# Altium schematic sheet Sheet1.SchDoc
size A4; SheetNumber: 5; SheetTotal: 5
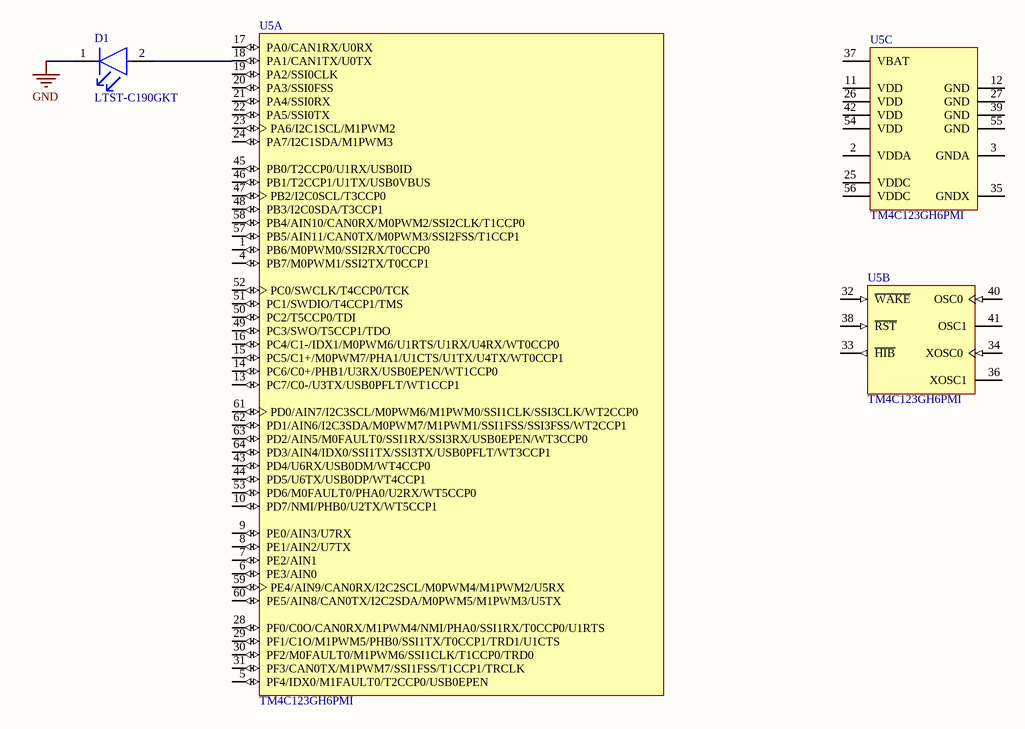
[diagram p0: Sheet1.SchDoc]

## Parts
D1  LTST-C190GKT  [FP-LTST-C190GKT-MFG]
U5  TM4C123GH6PMI  [PM0064A_L]  (parts A,B,C of 3)

## Nets
GND: D1.1(C)
NetD1_2: D1.2(A) U5.18(PA1/CAN1TX/U0TX)

Not connected (* = marked no-connect by the designer): U5 1(PB6/M0PWM0/SSI2RX/T0CCP0) 2(VDDA) 3(GNDA) 4(PB7/M0PWM1/SSI2TX/T0CCP1) 5(PF4/IDX0/M1FAULT0/T2CCP0/USB0EPEN) 6(PE3/AIN0) 7(PE2/AIN1) 8(PE1/AIN2/U7TX) 9(PE0/AIN3/U7RX) 10(PD7/NMI/PHB0/U2TX/WT5CCP1) 11(VDD) 12(GND) 13(PC7/C0-/U3TX/USB0PFLT/WT1CCP1) 14(PC6/C0+/PHB1/U3RX/USB0EPEN/WT1CCP0) 15(PC5/C1+/M0PWM7/PHA1/U1CTS/U1TX/U4TX/WT0CCP1) 16(PC4/C1-/IDX1/M0PWM6/U1RTS/U1RX/U4RX/WT0CCP0) 17(PA0/CAN1RX/U0RX) 19(PA2/SSI0CLK) 20(PA3/SSI0FSS) 21(PA4/SSI0RX) 22(PA5/SSI0TX) 23(PA6/I2C1SCL/M1PWM2) 24(PA7/I2C1SDA/M1PWM3) 25(VDDC) 26(VDD) 27(GND) 28(PF0/C0O/CAN0RX/M1PWM4/NMI/PHA0/SSI1RX/T0CCP0/U1RTS) 29(PF1/C1O/M1PWM5/PHB0/SSI1TX/T0CCP1/TRD1/U1CTS) 30(PF2/M0FAULT0/M1PWM6/SSI1CLK/T1CCP0/TRD0) 31(PF3/CAN0TX/M1PWM7/SSI1FSS/T1CCP1/TRCLK) 32(~{WAKE}) 33(~{HIB}) 34(XOSC0) 35(GNDX) 36(XOSC1) 37(VBAT) 38(~{RST}) 39(GND) 40(OSC0) 41(OSC1) 42(VDD) 43(PD4/U6RX/USB0DM/WT4CCP0) 44(PD5/U6TX/USB0DP/WT4CCP1) 45(PB0/T2CCP0/U1RX/USB0ID) 46(PB1/T2CCP1/U1TX/USB0VBUS) 47(PB2/I2C0SCL/T3CCP0) 48(PB3/I2C0SDA/T3CCP1) 49(PC3/SWO/T5CCP1/TDO) 50(PC2/T5CCP0/TDI) 51(PC1/SWDIO/T4CCP1/TMS) 52(PC0/SWCLK/T4CCP0/TCK) 53(PD6/M0FAULT0/PHA0/U2RX/WT5CCP0) 54(VDD) 55(GND) 56(VDDC) 57(PB5/AIN11/CAN0TX/M0PWM3/SSI2FSS/T1CCP1) 58(PB4/AIN10/CAN0RX/M0PWM2/SSI2CLK/T1CCP0) 59(PE4/AIN9/CAN0RX/I2C2SCL/M0PWM4/M1PWM2/U5RX) 60(PE5/AIN8/CAN0TX/I2C2SDA/M0PWM5/M1PWM3/U5TX) 61(PD0/AIN7/I2C3SCL/M0PWM6/M1PWM0/SSI1CLK/SSI3CLK/WT2CCP0) 62(PD1/AIN6/I2C3SDA/M0PWM7/M1PWM1/SSI1FSS/SSI3FSS/WT2CCP1) 63(PD2/AIN5/M0FAULT0/SSI1RX/SSI3RX/USB0EPEN/WT3CCP0) 64(PD3/AIN4/IDX0/SSI1TX/SSI3TX/USB0PFLT/WT3CCP1)

## Library data of the parts
D1 = CMP-22017-000005-2: LED GREEN CLEAR CHIP SMD; Dominant Wavelength: 569nm; Reverse Voltage: 5V; Lens Color: Colorless; Viewing Angle: 130°; Voltage: 2V; Forward Current: 30mA; Power Dissipation: 100mW; Luminous Intensity: 6mcd; Number of LEDs: 1; Forward Voltage: 2.1V; Wavelength: 565nm; Test Current: 10mA; Min Operating Temperature: -55°C; Lens Style: Clear; Mount: Surface Mount; Width: 0.8mm; Packaging: Tape and Reel; Lens Transparency: Clear; Case Code (Metric): 1608; Depth: 0.8mm; Case Code (Imperial): 0603; Case/Package: 0603; Number of Pins: 2; Max Operating Temperature: 85°C; Lead Free: Lead Free; Number of Elements: 1; Length: 1.6mm; Height: 0.8mm; Package Quantity: 1; Power Rating: 100mW; Radiation Hardening: No; Illumination Color: Green; Color: Green
U5 = CMP-0945-00006-2: Tiva C Series Microcontroller, 256 KB Flash, 32 KB SRAM, 12 Bit, 12 Channels, -40 to 85 degC, 64-Pin LQFP (PM), Green (RoHS & no Sb/Br); Manufacturer: Texas Instruments; Program Memory: 256 KB; UART: 4; ADC Channels: 12; Data Memory: 32 KB; Max Speed: 80 MHz; ADC Resolution: 12 Bit; GPIOs: 43; Tiva Series: Connected MCUs; Prefix: Qualified Device; I2C: 2; ComponentLink1URL: http://www.ti.com/; ComponentLink1Description: Manufacturer URL; PackageDescription: 64-Pin Plastic Quad Flatpack, Body 10 x 10 mm, Pitch 0.5 mm; Temperature Range: -40 to 85 degC; Mounting Technology: Surface Mount; ComponentLink3URL: http://www.ti.com/litv/pdf/mtqf008a; ComponentLink2Description: Datasheet; ComponentLink2URL: http://www.ti.com/lit/ds/symlink/tm4c123gh6pm.pdf; PartNumber: TM4C123GH6PMI; DatasheetVersion: Rev. 15741.2722; PackageReference: PM0064A; RoHS: TRUE; ComponentLink3Description: Package Specification; PackageVersion: 4040152/C